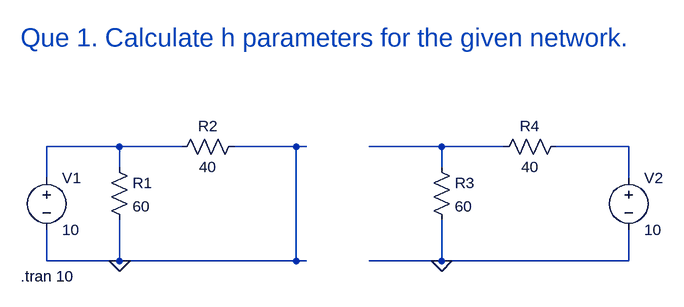
[diagram p0: schematic 1_Dheerendra_23EE019_Two_Port_H_para.asc]
1_Dheerendra_23EE019_Two_Port_H_para.asc, the LTspice schematic file:
Version 4
SHEET 1 880 680
WIRE -112 224 -224 224
WIRE -16 224 -112 224
WIRE 160 224 64 224
WIRE 176 224 160 224
WIRE 384 224 272 224
WIRE 480 224 384 224
WIRE 672 224 560 224
WIRE -112 256 -112 224
WIRE 384 256 384 224
WIRE -224 272 -224 224
WIRE 672 272 672 224
WIRE -224 400 -224 352
WIRE -112 400 -112 336
WIRE -112 400 -224 400
WIRE 160 400 160 224
WIRE 160 400 -112 400
WIRE 176 400 160 400
WIRE 384 400 384 336
WIRE 384 400 272 400
WIRE 672 400 672 352
WIRE 672 400 384 400
FLAG -112 400 0
FLAG 384 400 0
SYMBOL res -128 240 R0
SYMATTR InstName R1
SYMATTR Value 60
SYMBOL res 80 208 R90
WINDOW 0 0 56 VBottom 2
WINDOW 3 32 56 VTop 2
SYMATTR InstName R2
SYMATTR Value 40
SYMBOL res 368 240 R0
SYMATTR InstName R3
SYMATTR Value 60
SYMBOL res 576 208 R90
WINDOW 0 0 56 VBottom 2
WINDOW 3 32 56 VTop 2
SYMATTR InstName R4
SYMATTR Value 40
SYMBOL voltage -224 256 R0
WINDOW 123 0 0 Left 0
WINDOW 39 0 0 Left 0
SYMATTR InstName V1
SYMATTR Value 10
SYMBOL voltage 672 256 R0
WINDOW 123 0 0 Left 0
WINDOW 39 0 0 Left 0
SYMATTR InstName V2
SYMATTR Value 10
TEXT -264 56 Left 4 ;Que 1. Calculate h parameters for the given network.
TEXT -264 424 Left 2 !.tran 10

The netlist it stands for:
* 1_Dheerendra_23EE019_Two_Port_H_para.asc
R1 N001 0 60
R2 0 N001 40
R3 N002 0 60
R4 N003 N002 40
V1 N001 0 10
V2 N003 0 10
* Que 1. Calculate h parameters for the given network.
.tran 10
.backanno
.end